# Altium project n24_att.PrjPcb
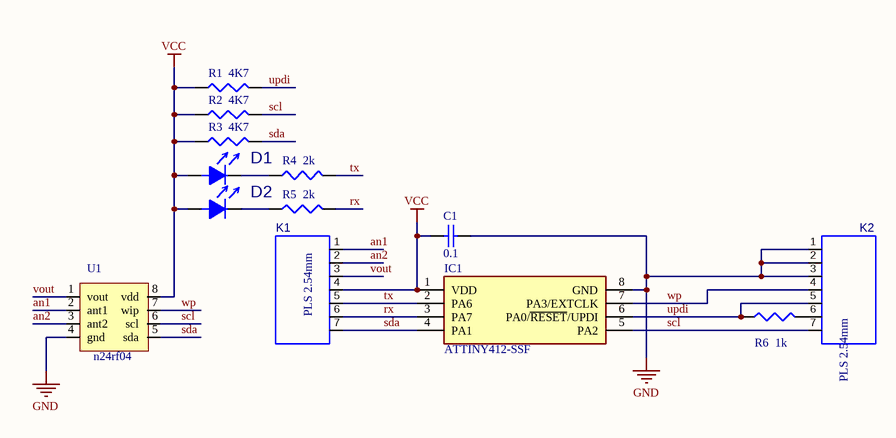
[diagram p0: n24_att.SchDoc]
1 sheet, 13 parts. Net scope: global (net labels, ports and power ports of the same name join across sheets).
Board file: n24_att.PcbDoc

## Sheet n24_att.SchDoc
size A4

### Parts
C1  value 0.1  [SM0805]  (hidden comment: cap0805)
D1  LIGHT_SM0805  [SM0805_diode]  (value not drawn)
D2  LIGHT_SM0805  [SM0805_diode]  (value not drawn)
IC1  ATTINY412-SSF  [SOIC127P600X175-8N]
K1  7_PLS_2.54mm  [7_PLS_2.54]  (value not drawn)
K2  7_PLS_2.54mm  [7_PLS_2.54]  (value not drawn)
R1  value 4K7  [SM0805]  (hidden comment: res0805)
R2  value 4K7  [SM0805]  (hidden comment: res0805)
R3  value 4K7  [SM0805]  (hidden comment: res0805)
R4  value 2k  [SM0805]  (hidden comment: res0805)
R5  value 2k  [SM0805]  (hidden comment: res0805)
R6  value 1k  [SM0805]  (hidden comment: res0805)
U1  n24rf04  [SO8_L]

### Nets
GND: C1.2 IC1.8(GND) K2.1 K2.2 K2.3 U1.4(gnd)
VCC: C1.1 D1.1(a) D2.1(a) IC1.1(VDD) K1.4 R1.1 R2.1 R3.1 U1.8(vdd)
an1: K1.1 U1.2(ant1)
an2: K1.2 U1.3(ant2)
rx: IC1.3(PA7) K1.6 R5.2
scl: IC1.5(PA2) K2.7 R2.2 U1.6(scl)
sda: IC1.4(PA1) K1.7 R3.2 U1.5(sda)
tx: IC1.2(PA6) K1.5 R4.2
updi: IC1.6(PA0/~{RESET}/UPDI) K2.5 R1.2 R6.1
vout: K1.3 U1.1(vout)
wp: IC1.7(PA3/EXTCLK) K2.4 U1.7(wip)
NetD1_2: D1.2(k) R4.1
NetD2_2: D2.2(k) R5.1
NetK2_6: K2.6 R6.2

### Notes on the sheet
- (in symbol 7_PLS_2.54mm) PLS 2.54mm

### Library data of the parts
C1 = cap0805: Capacitor; Published: 8-Jun-2000; LatestRevisionDate: 17-Jul-2002; LatestRevisionNote: Re-released for DXP Platform.; PackageReference: RAD-0.3; Publisher: Altium Limited; PackageDescription: Radial Cap, Thru-Hole; 2 Leads; 0.3 in Pin Spacing
IC1 = ATTINY412-SSF: Integrated Circuit; Manufacturer_Name: Microchip; Datasheet Link: https://componentsearchengine.com/Datasheets/1/ATTINY412-SSF.pdf; Height: 1.75mm; Manufacturer_Part_Number: ATTINY412-SSF; Mouser Part Number: 579-ATTINY412-SSF; Mouser Price/Stock: https://www.mouser.co.uk/ProductDetail/Microchip-Technology/ATTINY412-SSF?qs=3HJ2avRr9PLjr%252BAvU6bmFQ%3D%3D; Arrow Part Number: ATTINY412-SSF; Arrow Price/Stock: https://www.arrow.com/en/products/attiny412-ssf/microchip-technology
K1 K2 = 7_PLS_2.54mm: 7 pin vertical 2.54mm; Value: *
R1-R6 = res0805: Resistor; Published: 8-Jun-2000; LatestRevisionDate: 29-May-2009; LatestRevisionNote: IPC-7351 Footprint Added.; PackageReference: J1-0603; Publisher: Altium Limited; PackageDescription: Chip Resistor
U1 = n24rf04: eeprom & nfc tag
D1 D2 = LIGHT_SM0805: Value: *